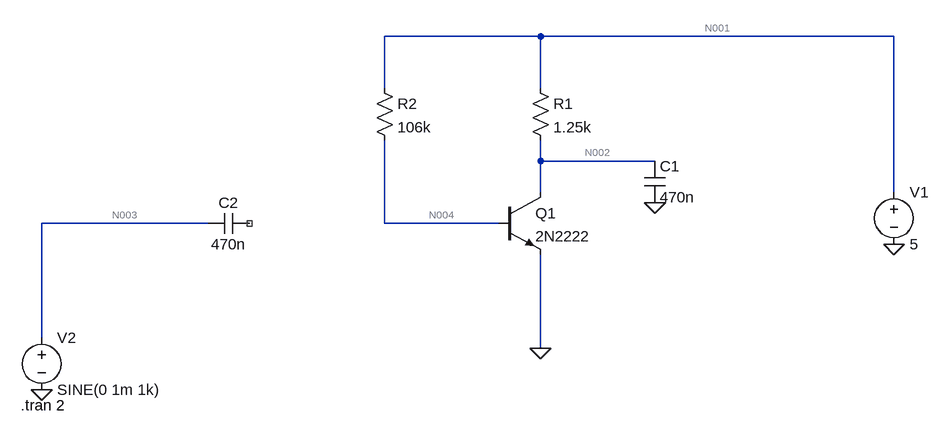
[diagram p0: schematic BJT.asc]
BJT.asc, the LTspice schematic file:
Version 4.1
SHEET 1 880 680
WIRE 256 -128 16 -128
WIRE 800 -128 256 -128
WIRE 16 -48 16 -128
WIRE 256 -48 256 -128
WIRE 256 64 256 32
WIRE 432 64 256 64
WIRE 256 112 256 64
WIRE 800 112 800 -128
WIRE -256 160 -512 160
WIRE 16 160 16 32
WIRE 192 160 16 160
WIRE -512 336 -512 160
WIRE 256 352 256 208
FLAG 256 352 0
FLAG 432 128 0
FLAG -512 416 0
FLAG 800 192 0
SYMBOL npn 192 112 R0
SYMATTR InstName Q1
SYMATTR Value 2N2222
SYMBOL voltage 800 96 R0
WINDOW 123 0 0 Left 0
WINDOW 39 0 0 Left 0
SYMATTR InstName V1
SYMATTR Value 5
SYMBOL voltage -512 320 R0
WINDOW 123 0 0 Left 0
WINDOW 39 0 0 Left 0
SYMATTR InstName V2
SYMATTR Value SINE(0 1m 1k)
SYMBOL res 240 -64 R0
SYMATTR InstName R1
SYMATTR Value 1.25k
SYMBOL res 0 -64 R0
SYMATTR InstName R2
SYMATTR Value 106k
SYMBOL cap 416 64 R0
SYMATTR InstName C1
SYMATTR Value 470n
SYMBOL cap -192 144 R90
WINDOW 0 0 32 VBottom 2
WINDOW 3 32 32 VTop 2
SYMATTR InstName C2
SYMATTR Value 470n
TEXT -544 440 Left 2 !.tran 2

The netlist it stands for:
* BJT.asc
Q1 N002 N004 0 0 2N2222
V1 N001 0 5
V2 N003 0 SINE(0 1m 1k)
R1 N001 N002 1.25k
R2 N001 N004 106k
C1 N002 0 470n
C2 NC_01 N003 470n
.model NPN NPN
.model PNP PNP
.lib standard.bjt
.tran 2
.backanno
.end

* Results of the author's LTspice run, read from the files saved beside the schematic
* Operating Point, zero values left out:
*   V(n004) = 692.6 mV
*   V(n002) = 110.7 mV
*   V(n001) = 5 V
*   Ic(Q1) = 3.911 mA
*   Ib(Q1) = 40.64 µA
*   Ie(Q1) = -3.952 mA
*   I(R2) = 40.64 µA
*   I(V1) = -3.952 mA
*   I(R1) = 3.911 mA
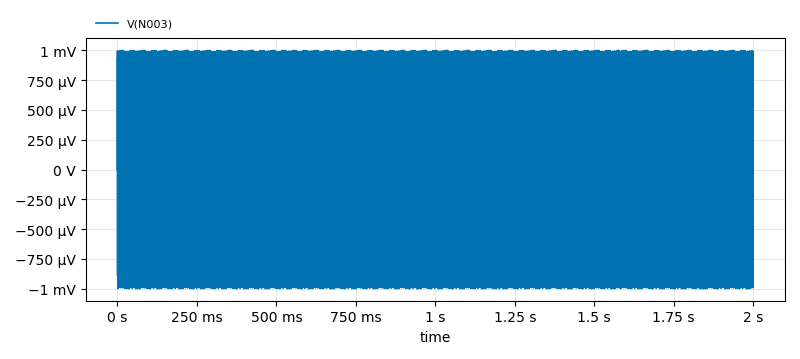
[diagram p1: Transient Analysis of BJT.asc, plotted from the saved traces]
* Transient Analysis, 1 run:
*   V(N003): min -1 mV, max 999.6 µV, average 61.82 nV, rms 721.8 µV, last 0 V